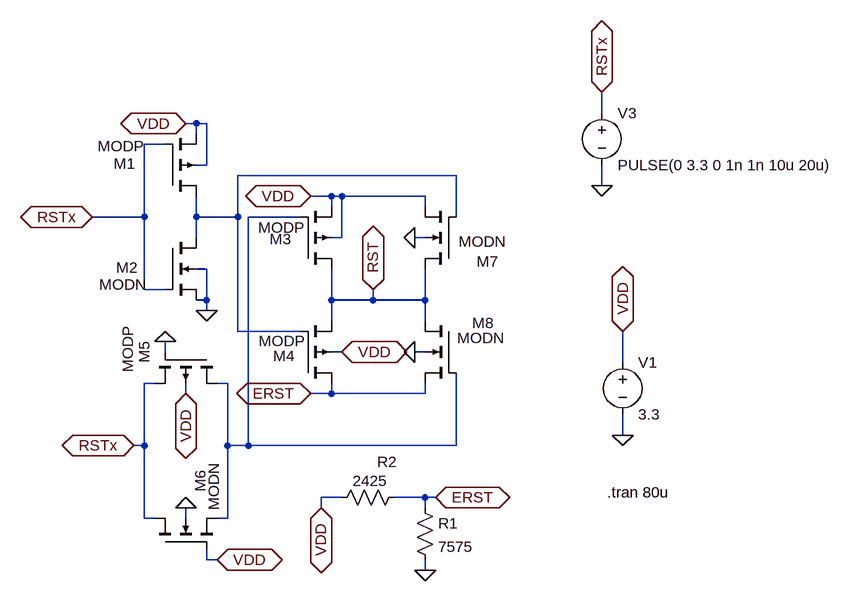
[diagram p0: schematic RST NOVO.asc]
RST NOVO.asc, the LTspice schematic file:
Version 4
SHEET 1 1124 848
WIRE -3584 -3504 -3584 -3536
WIRE -4208 -3488 -4224 -3488
WIRE -4192 -3488 -4208 -3488
WIRE -4208 -3472 -4208 -3488
WIRE -4256 -3456 -4288 -3456
WIRE -4192 -3424 -4192 -3488
WIRE -4192 -3424 -4208 -3424
WIRE -3808 -3408 -4144 -3408
WIRE -3584 -3392 -3584 -3424
WIRE -4000 -3376 -4032 -3376
WIRE -3984 -3376 -4000 -3376
WIRE -3856 -3376 -3984 -3376
WIRE -4000 -3360 -4000 -3376
WIRE -3856 -3360 -3856 -3376
WIRE -4288 -3344 -4288 -3456
WIRE -4288 -3344 -4368 -3344
WIRE -4208 -3344 -4208 -3376
WIRE -4144 -3344 -4144 -3408
WIRE -4144 -3344 -4208 -3344
WIRE -4048 -3344 -4128 -3344
WIRE -3808 -3344 -3808 -3408
WIRE -4208 -3312 -4208 -3344
WIRE -3984 -3312 -3984 -3376
WIRE -3984 -3312 -4000 -3312
WIRE -3856 -3312 -3872 -3312
WIRE -4192 -3264 -4208 -3264
WIRE -4288 -3232 -4288 -3344
WIRE -4256 -3232 -4288 -3232
WIRE -4192 -3216 -4192 -3264
WIRE -4192 -3216 -4208 -3216
WIRE -4000 -3216 -4000 -3264
WIRE -3936 -3216 -3936 -3232
WIRE -3936 -3216 -4000 -3216
WIRE -3856 -3216 -3856 -3264
WIRE -3856 -3216 -3936 -3216
WIRE -4192 -3200 -4192 -3216
WIRE -4000 -3184 -4000 -3216
WIRE -3856 -3184 -3856 -3216
WIRE -4144 -3168 -4144 -3344
WIRE -4048 -3168 -4144 -3168
WIRE -4256 -3136 -4256 -3152
WIRE -3984 -3136 -4000 -3136
WIRE -3856 -3136 -3872 -3136
WIRE -3552 -3120 -3552 -3168
WIRE -4272 -3088 -4288 -3088
WIRE -4160 -3088 -4176 -3088
WIRE -4224 -3072 -4224 -3088
WIRE -4000 -3072 -4000 -3088
WIRE -4000 -3072 -4032 -3072
WIRE -3856 -3072 -3856 -3088
WIRE -3856 -3072 -4000 -3072
WIRE -3552 -3008 -3552 -3040
WIRE -4288 -2992 -4288 -3088
WIRE -4288 -2992 -4304 -2992
WIRE -4160 -2992 -4160 -3088
WIRE -4128 -2992 -4128 -3344
WIRE -4128 -2992 -4160 -2992
WIRE -3808 -2992 -3808 -3104
WIRE -3808 -2992 -4128 -2992
WIRE -3984 -2912 -4016 -2912
WIRE -3856 -2912 -3904 -2912
WIRE -3840 -2912 -3856 -2912
WIRE -4016 -2896 -4016 -2912
WIRE -3856 -2896 -3856 -2912
WIRE -4288 -2880 -4288 -2992
WIRE -4272 -2880 -4288 -2880
WIRE -4224 -2880 -4224 -2896
WIRE -4160 -2880 -4160 -2992
WIRE -4160 -2880 -4176 -2880
WIRE -4192 -2816 -4192 -2832
WIRE -4176 -2816 -4192 -2816
WIRE -3856 -2800 -3856 -2816
FLAG -4192 -3200 0
FLAG -4224 -3488 VDD
IOPIN -4224 -3488 BiDir
FLAG -4368 -3344 RSTx
IOPIN -4368 -3344 BiDir
FLAG -3552 -3008 0
FLAG -3552 -3168 VDD
IOPIN -3552 -3168 BiDir
FLAG -3584 -3392 0
FLAG -3584 -3536 RSTx
IOPIN -3584 -3536 BiDir
FLAG -4032 -3376 VDD
IOPIN -4032 -3376 BiDir
FLAG -4032 -3072 ERST
IOPIN -4032 -3072 BiDir
FLAG -4176 -2816 VDD
IOPIN -4176 -2816 BiDir
FLAG -4304 -2992 RSTx
IOPIN -4304 -2992 BiDir
FLAG -4224 -2896 0
FLAG -3856 -2800 0
FLAG -4016 -2896 VDD
IOPIN -4016 -2896 BiDir
FLAG -3840 -2912 ERST
IOPIN -3840 -2912 BiDir
FLAG -4256 -3152 0
FLAG -4224 -3072 VDD
IOPIN -4224 -3072 BiDir
FLAG -3984 -3136 VDD
IOPIN -3984 -3136 BiDir
FLAG -3872 -3312 0
FLAG -3872 -3136 0
FLAG -3936 -3232 RST
IOPIN -3936 -3232 BiDir
SYMBOL pmos4 -4256 -3376 M180
WINDOW 0 -79 50 Left 2
WINDOW 3 -104 77 Left 2
SYMATTR InstName M1
SYMATTR Value MODP
SYMATTR Value2 l=0.35u w=0.7u
SYMBOL nmos4 -4256 -3312 R0
WINDOW 0 -75 46 Left 2
WINDOW 3 -101 72 Left 2
SYMATTR InstName M2
SYMATTR Value MODN
SYMATTR Value2 l=0.35u w=0.7u
SYMBOL voltage -3552 -3136 R0
SYMATTR InstName V1
SYMATTR Value 3.3
SYMBOL voltage -3584 -3520 R0
WINDOW 123 0 0 Left 2
WINDOW 39 0 0 Left 2
SYMATTR InstName V3
SYMATTR Value PULSE(0 3.3 0 1n 1n 10u 20u)
SYMBOL pmos4 -4048 -3264 M180
WINDOW 0 -47 46 Left 2
WINDOW 3 -65 64 Left 2
SYMATTR InstName M3
SYMATTR Value MODP
SYMATTR Value2 l=0.35u w=0.7u
SYMBOL pmos4 -4048 -3088 M180
WINDOW 0 -42 42 Left 2
WINDOW 3 -64 65 Left 2
SYMATTR InstName M4
SYMATTR Value MODP
SYMATTR Value2 l=0.35u w=0.7u
SYMBOL pmos4 -4176 -3136 R90
WINDOW 0 -16 112 Left 2
WINDOW 3 -40 137 Left 2
SYMATTR InstName M5
SYMATTR Value MODP
SYMATTR Value2 l=0.35u w=0.7u
SYMBOL nmos4 -4272 -2832 R270
WINDOW 0 88 70 Left 2
WINDOW 3 60 91 Left 2
SYMATTR InstName M6
SYMATTR Value MODN
SYMATTR Value2 l=0.35u w=0.7u
SYMBOL nmos4 -3808 -3264 R180
WINDOW 0 -65 11 Left 2
WINDOW 3 -77 42 Left 2
SYMATTR InstName M7
SYMATTR Value MODN
SYMATTR Value2 l=0.35u w=0.7u
SYMBOL nmos4 -3808 -3184 M0
WINDOW 0 -58 3 Left 2
WINDOW 3 -75 26 Left 2
SYMATTR InstName M8
SYMATTR Value MODN
SYMATTR Value2 l=0.35u w=0.7u
SYMBOL res -3872 -2912 R0
SYMATTR InstName R1
SYMATTR Value 7575
SYMBOL res -3888 -2928 R90
WINDOW 0 -23 26 VBottom 2
WINDOW 3 -25 52 VTop 2
SYMATTR InstName R2
SYMATTR Value 2425
TEXT -3576 -2920 Left 2 !.tran 80u

The netlist it stands for:
* RST NOVO.asc
M1 N001 RSTx VDD VDD MODP l=0.35u w=0.7u
M2 N001 RSTx 0 0 MODN l=0.35u w=0.7u
V1 VDD 0 3.3
V3 RSTx 0 PULSE(0 3.3 0 1n 1n 10u 20u)
M3 RST N002 VDD VDD MODP l=0.35u w=0.7u
M4 ERST N001 RST VDD MODP l=0.35u w=0.7u
M5 N002 0 RSTx VDD MODP l=0.35u w=0.7u
M6 RSTx VDD N002 0 MODN l=0.35u w=0.7u
M7 RST N001 VDD 0 MODN l=0.35u w=0.7u
M8 RST N002 ERST 0 MODN l=0.35u w=0.7u
R1 ERST 0 7575
R2 ERST VDD 2425
.model NMOS NMOS
.model PMOS PMOS
.lib standard.mos
.tran 80u
.backanno
.end